# EAGLE design icp_rocker (EAGLE 6.3)
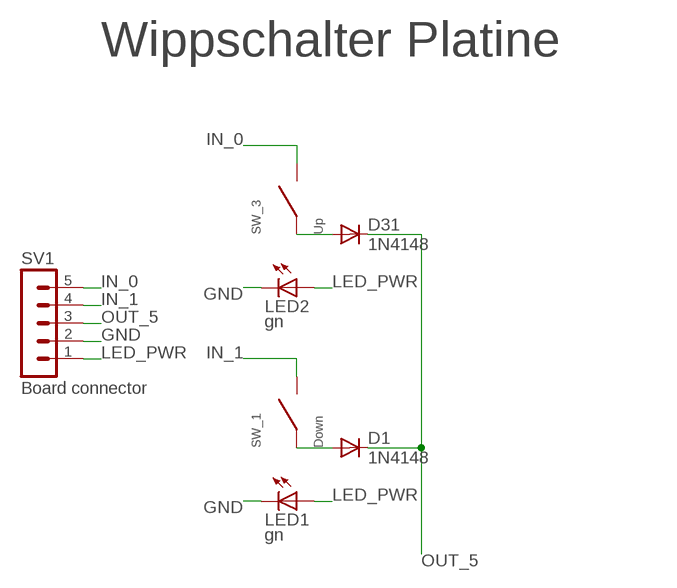
[diagram p0: schematic, sheet 1]

## Parts
D1  1N4148  DIODE-DO35-10  [DO35-10]
D31  1N4148  DIODE-DO35-10  [DO35-10]
LED1  gn  LEDCHIPLED_1206  [CHIPLED_1206]
LED2  gn  LEDCHIPLED_1206  [CHIPLED_1206]
SV1  Board connector  MA05-1  [MA05-1]
SW_1  Down  APEM_SWITCH  [TYPE_A]
SW_3  Up  APEM_SWITCH  [TYPE_A]

## Nets
GND: LED1.C LED2.C SV1.2
IN_0: SV1.5 SW_3.P$1
IN_1: SV1.4 SW_1.P$1
LED_PWR: LED1.A LED2.A SV1.1
N$1: D1.A SW_1.P$2
N$5: D31.A SW_3.P$2
OUT_5: D1.C D31.C SV1.3

## Notes on the sheet
- Wippschalter Platine

## Library data of the parts
D1 D31 = diode:DIODE-: DIODE
LED1 LED2 = led:LED: LED OSRAM: - CHIPLED LG R971, LG N971, LY N971, LG Q971, LY Q971, LO R971, LY R971 LH N974, LH R974 LS Q976, LO Q976, LY Q976 LO Q996 - Hyper CHIPLED LW Q18S LB Q993, LB Q99A, LB R99A - SideLED LS A670, LO A670, LY A670, LG A670, LP A670 LB A673, LV A673, LT A673, LW A673 LH A674 LY A675 LS A676, LA A676, LO A676, LY A676, LW A676 LS A679, LY A679, LG A679 - Hyper Micro SIDELED® LS Y876, LA Y876, LO Y876, LY Y876 LT Y87S - SmartLED LW L88C, LW L88S LB L89C, LB L89S, LG L890 LS L89K, LO L89K, LY L89K LS L896, LA L896, LO L896, LY L896 - TOPLED LS T670, LO T670, LY T670, LG T670, LP T670 LSG T670, LSP T670, LSY T670, LOP T670, LYG T670 LG T671, LOG T671, LSG T671 LB T673, LV T673, LT T673, LW T673 LH T674 LS T676, LA T676, LO T676, LY T676, LB T676, LH T676, LSB T676, LW T676 LB T67C, LV T67C, LT T67C, LS T67K, LO T67K, LY T67K, LW E67C LS E67B, LA E67B, LO E67B, LY E67B, LB E67C, LV E67C, LT E67C LW T67C LS T679, LY T679, LG T679 LS T770, LO T770, LY T770, LG T770, LP T770 LB T773, LV T773, LT T773, LW T773 LH T774 LS E675, LA E675, LY E675, LS T675 LS T776, LA T776, LO T776, LY T776, LB T776 LHGB T686 LT T68C, LB T68C - Hyper Mini TOPLED® LB M676 - Mini TOPLED Santana® LG M470 LS M47K, LO M47K, LY M47K Source: http://www.osram.convergy.de LUXEON: - LUMILED® LXK2-PW12-R00, LXK2-PW12-S00, LXK2-PW14-U00, LXK2-PW14-V00 LXK2-PM12-R00, LXK2-PM12-S00, LXK2-PM14-U00 LXK2-PE12-Q00, LXK2-PE12-R00, LXK2-PE12-S00, LXK2-PE14-T00, LXK2-PE14-U00 LXK2-PB12-K00, LXK2-PB12-L00, LXK2-PB12-M00, LXK2-PB14-N00, LXK2-PB14-P00, LXK2-PB14-Q00 LXK2-PR12-L00, LXK2-PR12-M00, LXK2-PR14-Q00, LXK2-PR14-R00 LXK2-PD12-Q00, LXK2-PD12-R00, LXK2-PD12-S00 LXK2-PH12-R00, LXK2-PH12-S00 LXK2-PL12-P00, LXK2-PL12-Q00, LXK2-PL12-R00 Source: www.luxeon.com KINGBRIGHT: KA-3528ASYC Source: www.kingbright.com
SV1 = con-lstb:MA05-1: PIN HEADER; OC_FARNELL: unknown; OC_NEWARK: unknown
SW_1 SW_3 = switches:APEM_SWITCH: slim single pole switches; RS_ONLINE: 378-6296

## Board
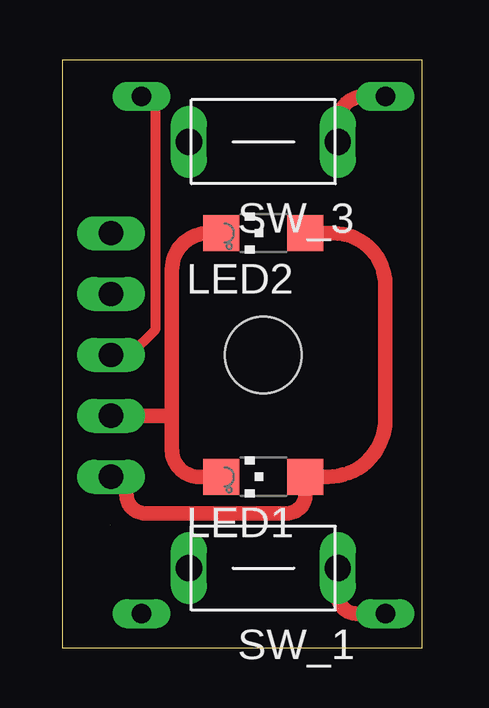
[diagram p1: board, top side]
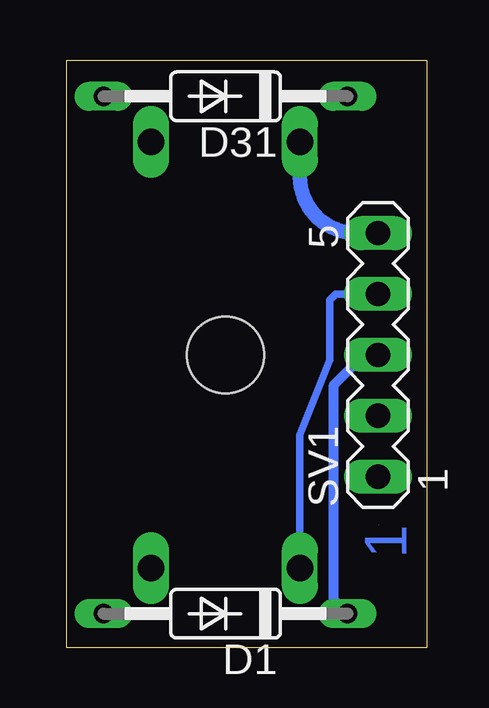
[diagram p2: board, bottom side, seen from below]

Size 15 x 24.5 mm. Coordinates in mm from the lower left corner, seen from the top.
Outline: 0,0 15,0 15,24.5 0,24.5 0,0
Copper layers (1*16): Top 0.035mm / dielectric 1.5mm / Bottom 0.035mm
Design rules "PCB-POOL Standard": minimum track width 0.15mm, minimum drill 0.3mm, track to track 0.15mm, track to pad 0.15mm, pad to pad 0.15mm, via to via 0.15mm, smd to smd 0.15mm, copper to edge 0.3mm, drill to drill 0.2mm, minimum pad ring 0.2mm, minimum via ring 0.15mm, stop-mask expansion 0.075mm, vias tented up to drill 0mil, thermal gap 0.2mm
Holes 3.2 mm at 8.39,12.2

### Footprints (pad centres in the part's own frame; a part is rotated, then mirrored left to right if it is on the bottom)
DO35-10 = drill 0.813 long: A 5.08,0; C -5.08,0
CHIPLED_1206 = smd 1.5 x 1.5: A 0,-1.75; C 0,1.75
MA05-1 = drill 1.016 long: 1 -5.08,0; 2 -2.54,0; 3 0,0; 4 2.54,0; 5 5.08,0
TYPE_A = drill 1.1 long: P$1 0,3.1; P$2 0,-3.1

### Placement (x,y rotation side)
D1  8.39,1.42 180 bottom
D31  8.39,22.98 180 bottom
LED1  8.39,7.12 90 top
LED2  8.39,17.28 90 top
SV1  2.04,12.2 90 bottom
SW_1  8.39,3.31 90 top
SW_3  8.39,21.09 90 top

### Tracks (layer width: path | path; a pad name or v marks a point on that pad's centre or on a via)
GND
  Top 0.61: LED2.C 6.11,17.28 arc90 4.58,15.75 4.58,9.66 | 4.58,9.66 4.58,8.25 arc90 5.71,7.12 LED1.C | SV1.2 4.58,9.66
IN_0
  Bottom 0.61: SW_3.P$1 5.29,19.64 arc-90 2.93,17.28 SV1.5
IN_1
  Bottom 0.305: SV1.4 3.79,14.74 4.04,14.49 4.04,12 5.29,8.88 SW_1.P$1
LED_PWR
  Top 0.61: LED2.A 11.3,17.28 arc-90 13.47,15.11 13.47,9.51 arc-90 11.08,7.12 LED1.A 10.14,6.38 arc-90 9.37,5.6 3.46,5.6 arc-90 2.69,6.38 2.69,7.12 SV1.1
N$1
  Top 0.61: D1.A 12.27,1.42 arc-90 11.49,2.19 SW_1.P$2
N$2  (1 unrouted)
N$5
  Top 0.305: 11.49,21.88 SW_3.P$2
  Top 0.61: D31.A 12.6,22.98 arc90 11.49,21.88
OUT_5
  Top 0.406: D31.C 3.88,22.98 3.88,13.25 2.83,12.2 SV1.3
  Bottom 0.406: D1.C 3.88,1.98 3.88,10.95 2.62,12.2 SV1.3

### Text on the board
Bottom: 1